# Altium schematic sheet 题目二原理图.SchDoc
size A4
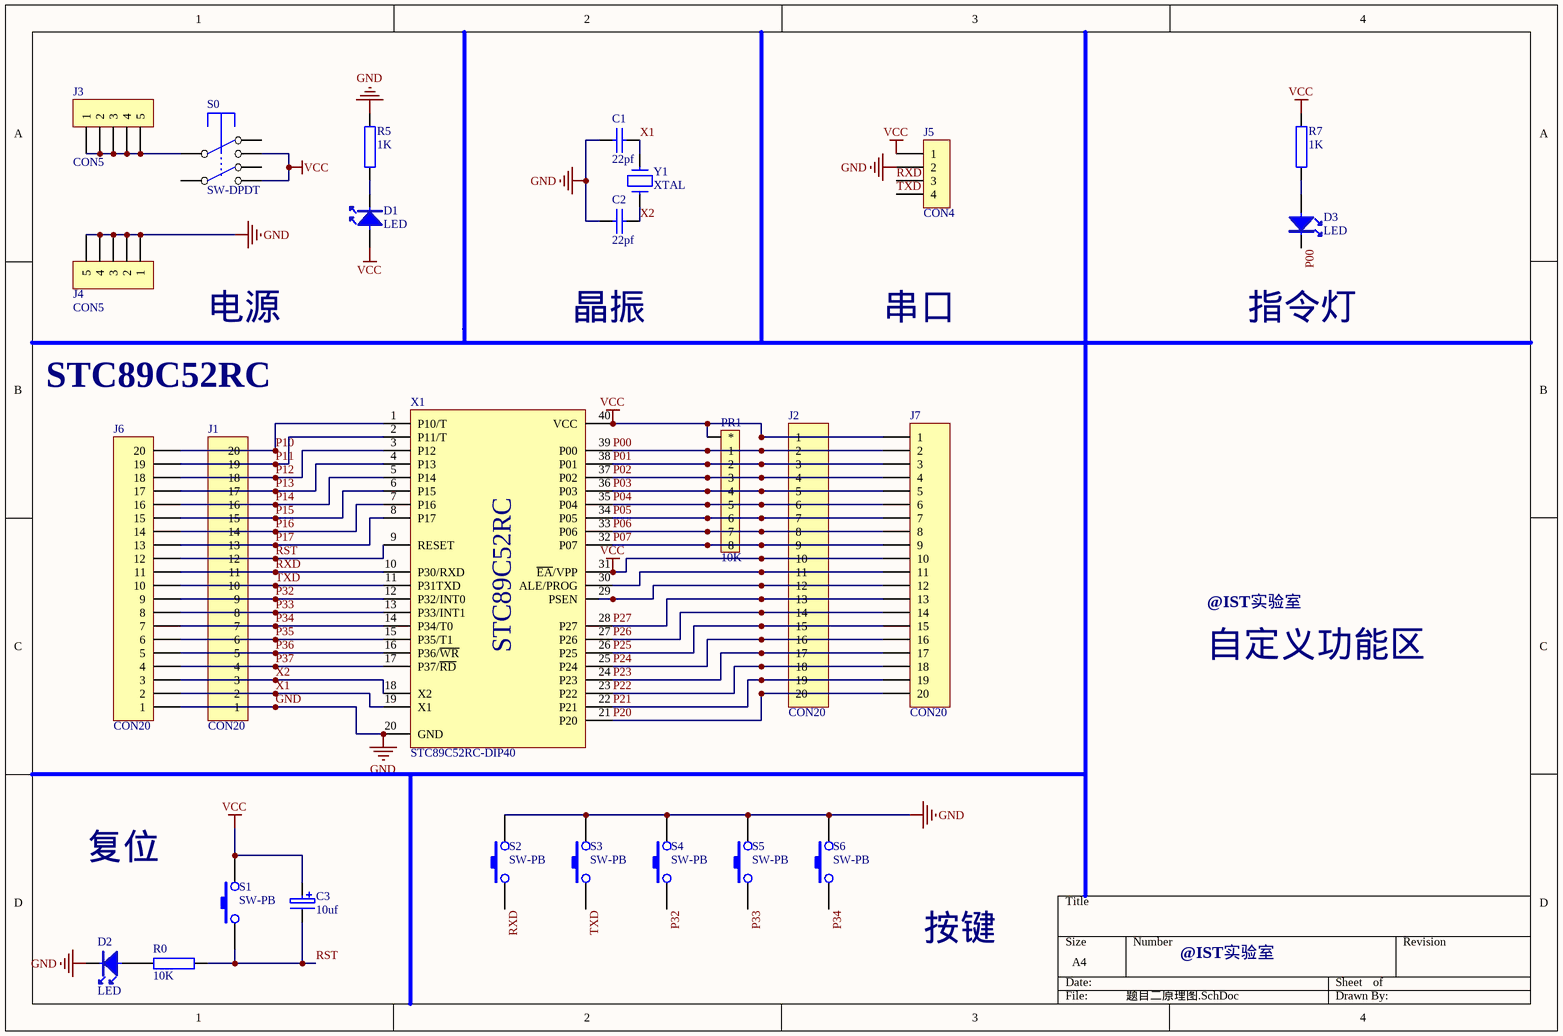
[diagram p0: 题目二原理图.SchDoc]

## Parts
C1  22pf  [CAP2]
C2  22pf  [CAP2]
C3  10uf  [CAO1]
D1  LED  [LED2_B]
D2  LED  [LED2_B]
D3  LED  [LED2_B]
J1  CON20  [sip-20]
J2  CON20  [sip-20]
J3  CON5  [sip-5]
J4  CON5  [sip-5]
J5  CON4  [sip-4]
J6  CON20  [sip-20]
J7  CON20  [sip-20]
PR1  10K  [RP1]
R0  10K  [AXIAL0.4]
R5  1K  [AXIAL0.4]
R7  1K  [AXIAL0.4]
S0  SW-DPDT  [SWH7*7]
S1  SW-PB  [SW6*6]
S2  SW-PB  [SW6*6]
S3  SW-PB  [SW6*6]
S4  SW-PB  [SW6*6]
S5  SW-PB  [SW6*6]
S6  SW-PB  [SW6*6]
X1  STC89C52RC-DIP40  [DIP-40]
Y1  XTAL  [XTAL1]

## Nets
GND: C1.2 C2.2 D2.2 J1.1 J4.1 J4.2 J4.3 J4.4 J4.5 J5.2 J6.1 R5.2 S2.2 S3.2 S4.2 S5.2 S6.2 X1.20(GND)
VCC: C3.1 D1.1 J2.1 J2.10 J5.1 J7.1 J7.10 PR1.1 R7.2 S0.3 S0.4 S1.2 X1.31(~{EA}/VPP) X1.40(VCC)
P00: D3.2 J2.2 J7.2 PR1.2(1) X1.39(P00)
P01: J2.3 J7.3 PR1.3(2) X1.38(P01)
P02: J2.4 J7.4 PR1.4(3) X1.37(P02)
P03: J2.5 J7.5 PR1.5(4) X1.36(P03)
P04: J2.6 J7.6 PR1.6(5) X1.35(P04)
P05: J2.7 J7.7 PR1.7(6) X1.34(P05)
P06: J2.8 J7.8 PR1.8(7) X1.33(P06)
P07: J2.9 J7.9 PR1.9(8) X1.32(P07)
P10: J1.20 J6.20 X1.1(P10/T)
P11: J1.19 J6.19 X1.2(P11/T)
P12: J1.18 J6.18 X1.3(P12)
P13: J1.17 J6.17 X1.4(P13)
P14: J1.16 J6.16 X1.5(P14)
P15: J1.15 J6.15 X1.6(P15)
P16: J1.14 J6.14 X1.7(P16)
P17: J1.13 J6.13 X1.8(P17)
P20: J2.20 J7.20 X1.21(P20)
P21: J2.19 J7.19 X1.22(P21)
P22: J2.18 J7.18 X1.23(P22)
P23: J2.17 J7.17 X1.24(P23)
P24: J2.16 J7.16 X1.25(P24)
P25: J2.15 J7.15 X1.26(P25)
P26: J2.14 J7.14 X1.27(P26)
P27: J2.13 J7.13 X1.28(P27)
P32: J1.9 J6.9 S4.1 X1.12(P32/INT0)
P33: J1.8 J6.8 S5.1 X1.13(P33/INT1)
P34: J1.7 J6.7 S6.1 X1.14(P34/T0)
P35: J1.6 J6.6 X1.15(P35/T1)
P36: J1.5 J6.5 X1.16(P36/~{WR})
P37: J1.4 J6.4 X1.17(P37/~{RD})
RST: C3.2 J1.12 J6.12 R0.2 S1.1 X1.9(RESET)
RXD: J1.11 J5.3 J6.11 S2.1 X1.10(P30/RXD)
TXD: J1.10 J5.4 J6.10 S3.1 X1.11(P31TXD)
X1: C1.1 J1.2 J6.2 X1.19(X1) Y1.2
X2: C2.1 J1.3 J6.3 X1.18(X2) Y1.1
NetD1_2: D1.2 R5.1
NetD2_1: D2.1 R0.1
NetD3_1: D3.1 R7.1
NetJ2_11: J2.11 J7.11 X1.30(ALE/PROG)
NetJ2_12: J2.12 J7.12 X1.29(PSEN)
NetJ3_1: J3.1 J3.2 J3.3 J3.4 J3.5 S0.2

Not connected (* = marked no-connect by the designer): S0 1 5 6

## Notes on the sheet
- 电源
- 晶振
- 串口
- 指令灯
- STC89C52RC
- @IST实验室
- 自定义功能区
- 复位
- 按键
- (in symbol STC89C52RC-DIP40) STC89C52RC

## Library data of the parts
C1 C2 = CAP1
C3 = CAP3
J1 J2 J6 J7 = CON20: Connector
J3 J4 = CON5: Connector
J5 = CON4: Connector
PR1 = PRES1
R0 R5 R7 = RES: 电阻
Y1 = CPY